# Altium schematic sheet VDD_GND.SchDoc
size E
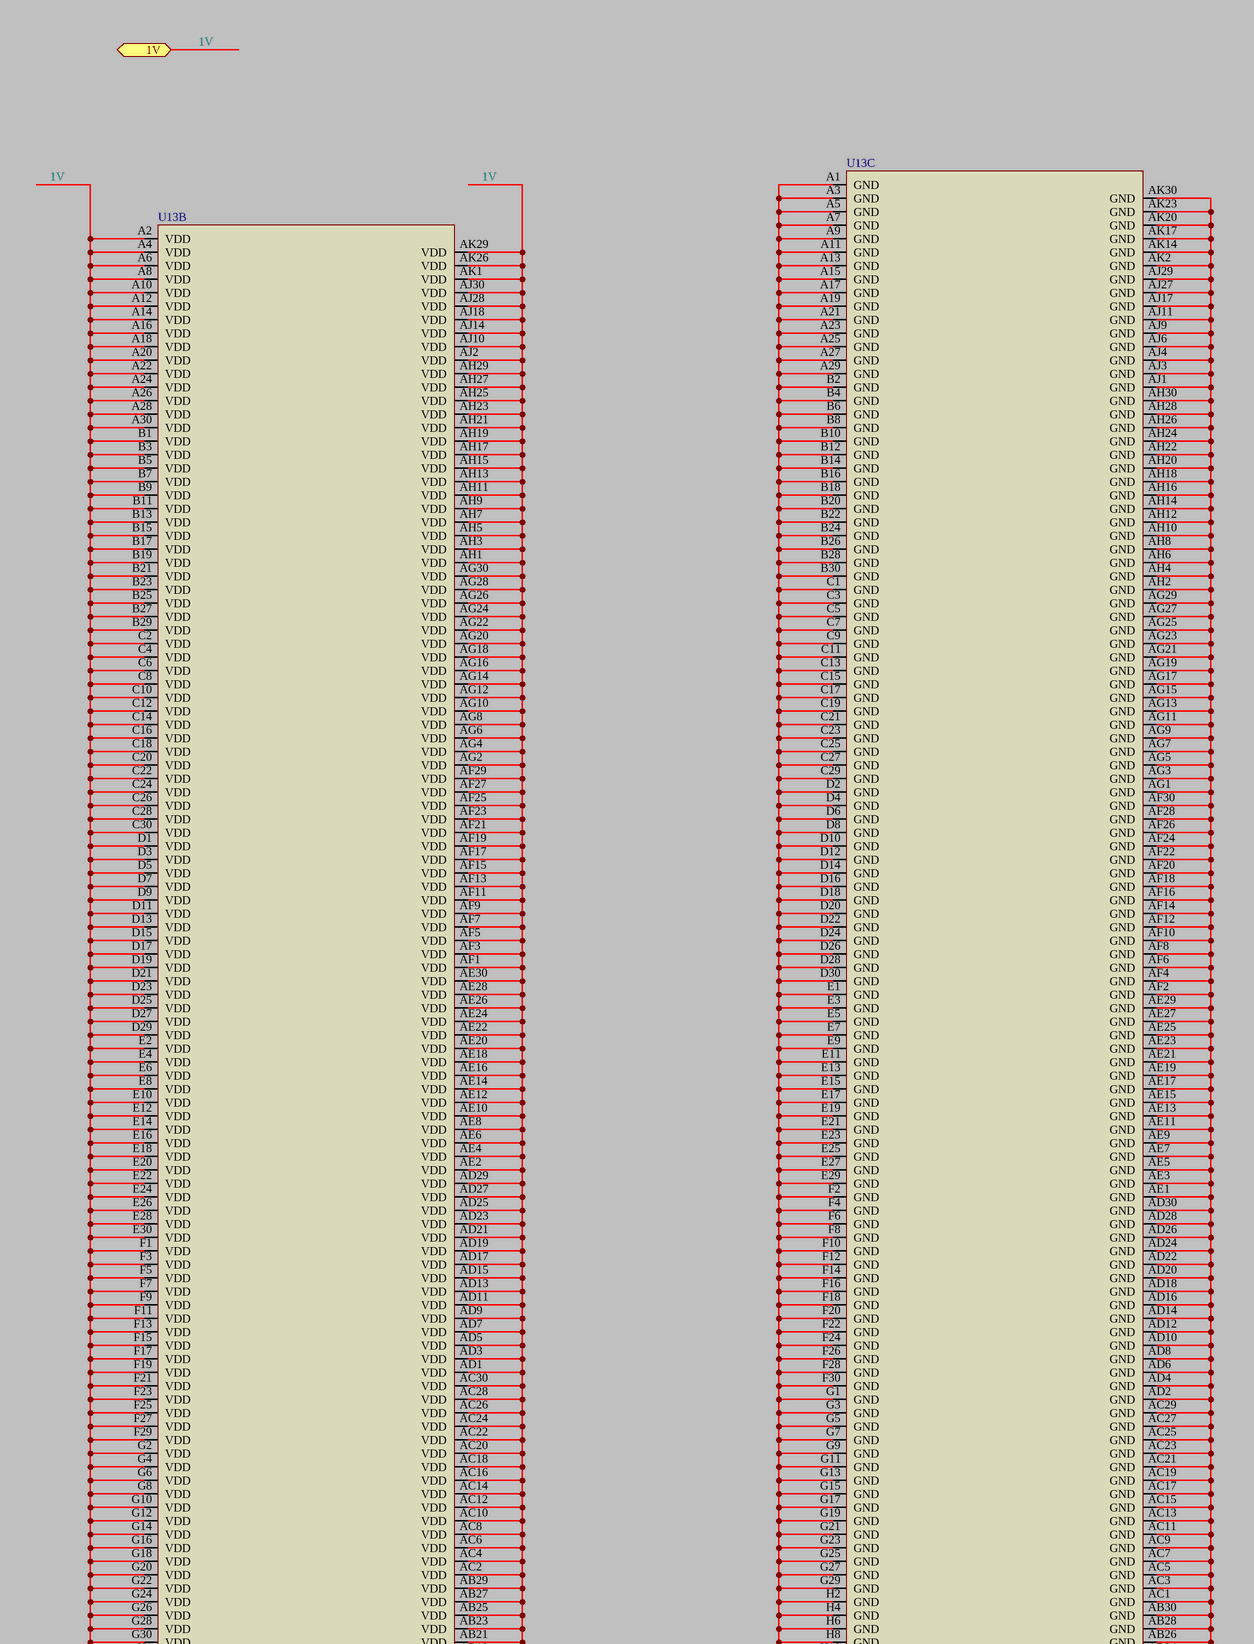
[diagram p0: VDD_GND.SchDoc, top left]
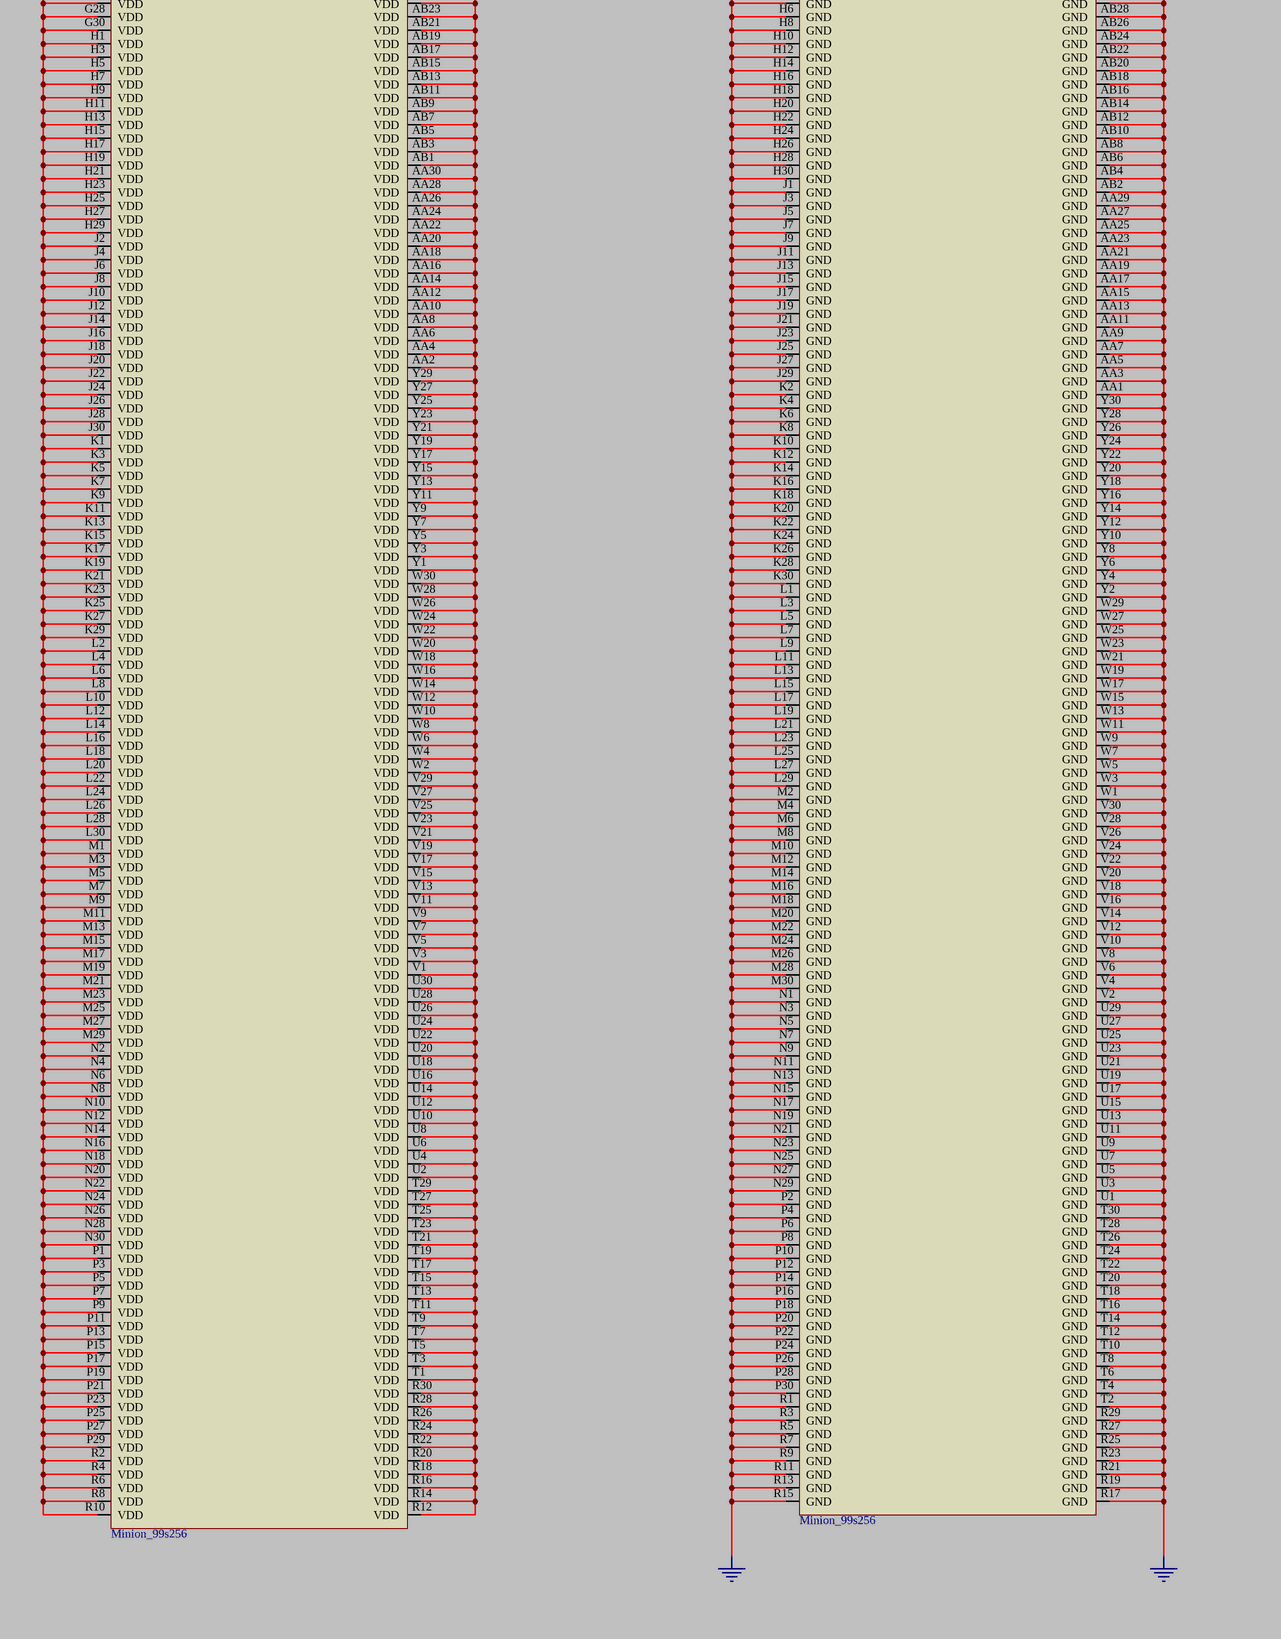
[diagram p1: VDD_GND.SchDoc, bottom left]
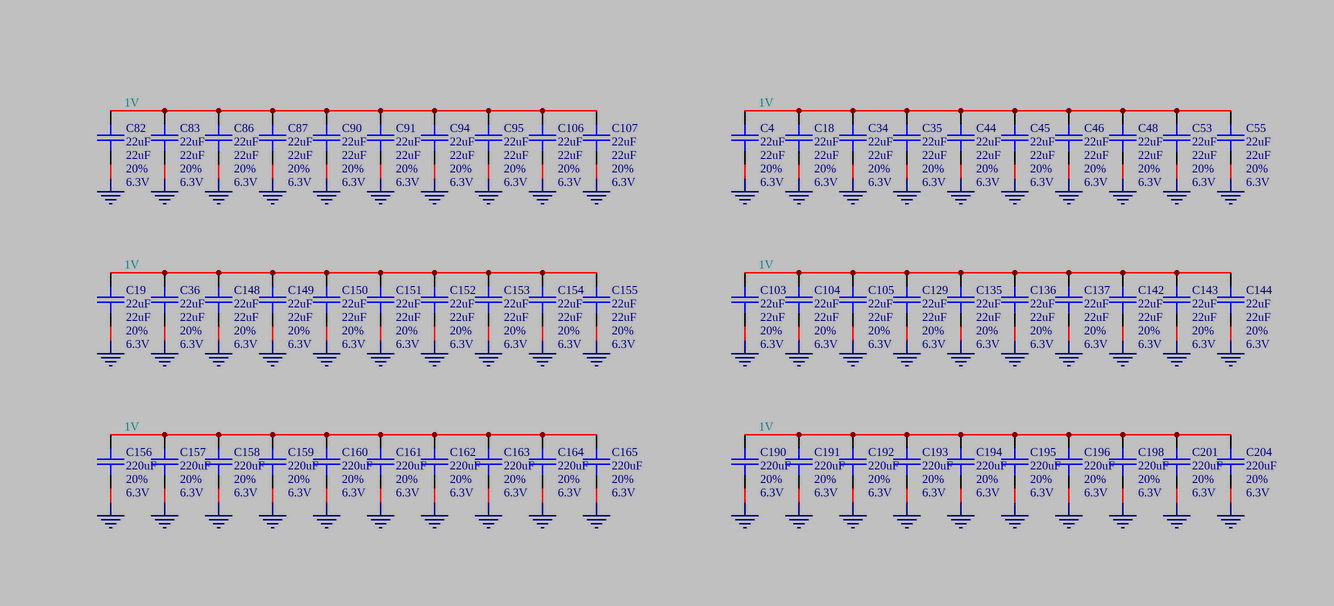
[diagram p2: VDD_GND.SchDoc, bottom middle]
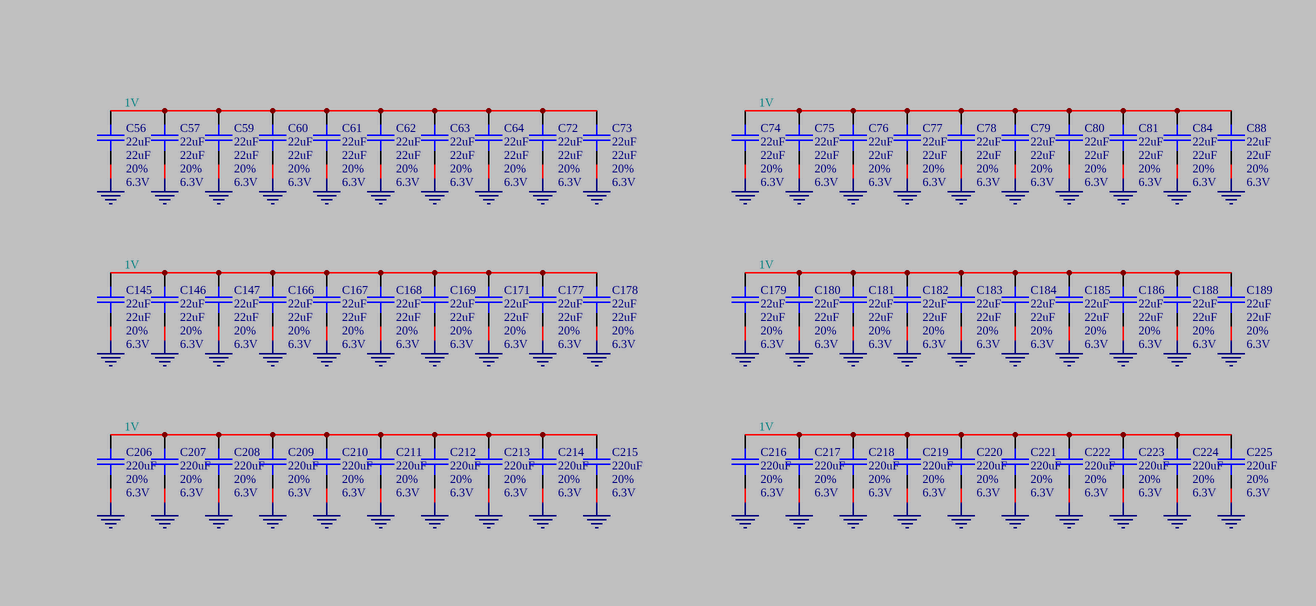
[diagram p3: VDD_GND.SchDoc, bottom right]

## Parts
C4  22uF  DB_TOLERANCE: 20%  DB_VOLTAGE: 6.3V  [SMD_0805_CAPC2012X145N]
C18  22uF  DB_TOLERANCE: 20%  DB_VOLTAGE: 6.3V  [SMD_0805_CAPC2012X145N]
C19  22uF  DB_TOLERANCE: 20%  DB_VOLTAGE: 6.3V  [SMD_0805_CAPC2012X145N]
C34  22uF  DB_TOLERANCE: 20%  DB_VOLTAGE: 6.3V  [SMD_0805_CAPC2012X145N]
C35  22uF  DB_TOLERANCE: 20%  DB_VOLTAGE: 6.3V  [SMD_0805_CAPC2012X145N]
C36  22uF  DB_TOLERANCE: 20%  DB_VOLTAGE: 6.3V  [SMD_0805_CAPC2012X145N]
C44  22uF  DB_TOLERANCE: 20%  DB_VOLTAGE: 6.3V  [SMD_0805_CAPC2012X145N]
C45  22uF  DB_TOLERANCE: 20%  DB_VOLTAGE: 6.3V  [SMD_0805_CAPC2012X145N]
C46  22uF  DB_TOLERANCE: 20%  DB_VOLTAGE: 6.3V  [SMD_0805_CAPC2012X145N]
C48  22uF  DB_TOLERANCE: 20%  DB_VOLTAGE: 6.3V  [SMD_0805_CAPC2012X145N]
C53  22uF  DB_TOLERANCE: 20%  DB_VOLTAGE: 6.3V  [SMD_0805_CAPC2012X145N]
C55  22uF  DB_TOLERANCE: 20%  DB_VOLTAGE: 6.3V  [SMD_0805_CAPC2012X145N]
C56  22uF  DB_TOLERANCE: 20%  DB_VOLTAGE: 6.3V  [SMD_0805_CAPC2012X145N]
C57  22uF  DB_TOLERANCE: 20%  DB_VOLTAGE: 6.3V  [SMD_0805_CAPC2012X145N]
C59  22uF  DB_TOLERANCE: 20%  DB_VOLTAGE: 6.3V  [SMD_0805_CAPC2012X145N]
C60  22uF  DB_TOLERANCE: 20%  DB_VOLTAGE: 6.3V  [SMD_0805_CAPC2012X145N]
C61  22uF  DB_TOLERANCE: 20%  DB_VOLTAGE: 6.3V  [SMD_0805_CAPC2012X145N]
C62  22uF  DB_TOLERANCE: 20%  DB_VOLTAGE: 6.3V  [SMD_0805_CAPC2012X145N]
C63  22uF  DB_TOLERANCE: 20%  DB_VOLTAGE: 6.3V  [SMD_0805_CAPC2012X145N]
C64  22uF  DB_TOLERANCE: 20%  DB_VOLTAGE: 6.3V  [SMD_0805_CAPC2012X145N]
C72  22uF  DB_TOLERANCE: 20%  DB_VOLTAGE: 6.3V  [SMD_0805_CAPC2012X145N]
C73  22uF  DB_TOLERANCE: 20%  DB_VOLTAGE: 6.3V  [SMD_0805_CAPC2012X145N]
C74  22uF  DB_TOLERANCE: 20%  DB_VOLTAGE: 6.3V  [SMD_0805_CAPC2012X145N]
C75  22uF  DB_TOLERANCE: 20%  DB_VOLTAGE: 6.3V  [SMD_0805_CAPC2012X145N]
C76  22uF  DB_TOLERANCE: 20%  DB_VOLTAGE: 6.3V  [SMD_0805_CAPC2012X145N]
C77  22uF  DB_TOLERANCE: 20%  DB_VOLTAGE: 6.3V  [SMD_0805_CAPC2012X145N]
C78  22uF  DB_TOLERANCE: 20%  DB_VOLTAGE: 6.3V  [SMD_0805_CAPC2012X145N]
C79  22uF  DB_TOLERANCE: 20%  DB_VOLTAGE: 6.3V  [SMD_0805_CAPC2012X145N]
C80  22uF  DB_TOLERANCE: 20%  DB_VOLTAGE: 6.3V  [SMD_0805_CAPC2012X145N]
C81  22uF  DB_TOLERANCE: 20%  DB_VOLTAGE: 6.3V  [SMD_0805_CAPC2012X145N]
C82  22uF  DB_TOLERANCE: 20%  DB_VOLTAGE: 6.3V  [SMD_0805_CAPC2012X145N]
C83  22uF  DB_TOLERANCE: 20%  DB_VOLTAGE: 6.3V  [SMD_0805_CAPC2012X145N]
C84  22uF  DB_TOLERANCE: 20%  DB_VOLTAGE: 6.3V  [SMD_0805_CAPC2012X145N]
C86  22uF  DB_TOLERANCE: 20%  DB_VOLTAGE: 6.3V  [SMD_0805_CAPC2012X145N]
C87  22uF  DB_TOLERANCE: 20%  DB_VOLTAGE: 6.3V  [SMD_0805_CAPC2012X145N]
C88  22uF  DB_TOLERANCE: 20%  DB_VOLTAGE: 6.3V  [SMD_0805_CAPC2012X145N]
C90  22uF  DB_TOLERANCE: 20%  DB_VOLTAGE: 6.3V  [SMD_0805_CAPC2012X145N]
C91  22uF  DB_TOLERANCE: 20%  DB_VOLTAGE: 6.3V  [SMD_0805_CAPC2012X145N]
C94  22uF  DB_TOLERANCE: 20%  DB_VOLTAGE: 6.3V  [SMD_0805_CAPC2012X145N]
C95  22uF  DB_TOLERANCE: 20%  DB_VOLTAGE: 6.3V  [SMD_0805_CAPC2012X145N]
C103  22uF  DB_TOLERANCE: 20%  DB_VOLTAGE: 6.3V  [SMD_0805_CAPC2012X145N]
C104  22uF  DB_TOLERANCE: 20%  DB_VOLTAGE: 6.3V  [SMD_0805_CAPC2012X145N]
C105  22uF  DB_TOLERANCE: 20%  DB_VOLTAGE: 6.3V  [SMD_0805_CAPC2012X145N]
C106  22uF  DB_TOLERANCE: 20%  DB_VOLTAGE: 6.3V  [SMD_0805_CAPC2012X145N]
C107  22uF  DB_TOLERANCE: 20%  DB_VOLTAGE: 6.3V  [SMD_0805_CAPC2012X145N]
C129  22uF  DB_TOLERANCE: 20%  DB_VOLTAGE: 6.3V  [SMD_0805_CAPC2012X145N]
C135  22uF  DB_TOLERANCE: 20%  DB_VOLTAGE: 6.3V  [SMD_0805_CAPC2012X145N]
C136  22uF  DB_TOLERANCE: 20%  DB_VOLTAGE: 6.3V  [SMD_0805_CAPC2012X145N]
C137  22uF  DB_TOLERANCE: 20%  DB_VOLTAGE: 6.3V  [SMD_0805_CAPC2012X145N]
C142  22uF  DB_TOLERANCE: 20%  DB_VOLTAGE: 6.3V  [SMD_0805_CAPC2012X145N]
C143  22uF  DB_TOLERANCE: 20%  DB_VOLTAGE: 6.3V  [SMD_0805_CAPC2012X145N]
C144  22uF  DB_TOLERANCE: 20%  DB_VOLTAGE: 6.3V  [SMD_0805_CAPC2012X145N]
C145  22uF  DB_TOLERANCE: 20%  DB_VOLTAGE: 6.3V  [SMD_0805_CAPC2012X145N]
C146  22uF  DB_TOLERANCE: 20%  DB_VOLTAGE: 6.3V  [SMD_0805_CAPC2012X145N]
C147  22uF  DB_TOLERANCE: 20%  DB_VOLTAGE: 6.3V  [SMD_0805_CAPC2012X145N]
C148  22uF  DB_TOLERANCE: 20%  DB_VOLTAGE: 6.3V  [SMD_0805_CAPC2012X145N]
C149  22uF  DB_TOLERANCE: 20%  DB_VOLTAGE: 6.3V  [SMD_0805_CAPC2012X145N]
C150  22uF  DB_TOLERANCE: 20%  DB_VOLTAGE: 6.3V  [SMD_0805_CAPC2012X145N]
C151  22uF  DB_TOLERANCE: 20%  DB_VOLTAGE: 6.3V  [SMD_0805_CAPC2012X145N]
C152  22uF  DB_TOLERANCE: 20%  DB_VOLTAGE: 6.3V  [SMD_0805_CAPC2012X145N]
C153  22uF  DB_TOLERANCE: 20%  DB_VOLTAGE: 6.3V  [SMD_0805_CAPC2012X145N]
C154  22uF  DB_TOLERANCE: 20%  DB_VOLTAGE: 6.3V  [SMD_0805_CAPC2012X145N]
C155  22uF  DB_TOLERANCE: 20%  DB_VOLTAGE: 6.3V  [SMD_0805_CAPC2012X145N]
C156  DB_TOLERANCE: 20%  DB_VOLTAGE: 6.3V  [SMD_1210_CAPC3225X279N]  (hidden comment: 220uF)
C157  DB_TOLERANCE: 20%  DB_VOLTAGE: 6.3V  [SMD_1210_CAPC3225X279N]  (hidden comment: 220uF)
C158  DB_TOLERANCE: 20%  DB_VOLTAGE: 6.3V  [SMD_1210_CAPC3225X279N]  (hidden comment: 220uF)
C159  DB_TOLERANCE: 20%  DB_VOLTAGE: 6.3V  [SMD_1210_CAPC3225X279N]  (hidden comment: 220uF)
C160  DB_TOLERANCE: 20%  DB_VOLTAGE: 6.3V  [SMD_1210_CAPC3225X279N]  (hidden comment: 220uF)
C161  DB_TOLERANCE: 20%  DB_VOLTAGE: 6.3V  [SMD_1210_CAPC3225X279N]  (hidden comment: 220uF)
C162  DB_TOLERANCE: 20%  DB_VOLTAGE: 6.3V  [SMD_1210_CAPC3225X279N]  (hidden comment: 220uF)
C163  DB_TOLERANCE: 20%  DB_VOLTAGE: 6.3V  [SMD_1210_CAPC3225X279N]  (hidden comment: 220uF)
C164  DB_TOLERANCE: 20%  DB_VOLTAGE: 6.3V  [SMD_1210_CAPC3225X279N]  (hidden comment: 220uF)
C165  DB_TOLERANCE: 20%  DB_VOLTAGE: 6.3V  [SMD_1210_CAPC3225X279N]  (hidden comment: 220uF)
C166  22uF  DB_TOLERANCE: 20%  DB_VOLTAGE: 6.3V  [SMD_0805_CAPC2012X145N]
C167  22uF  DB_TOLERANCE: 20%  DB_VOLTAGE: 6.3V  [SMD_0805_CAPC2012X145N]
C168  22uF  DB_TOLERANCE: 20%  DB_VOLTAGE: 6.3V  [SMD_0805_CAPC2012X145N]
C169  22uF  DB_TOLERANCE: 20%  DB_VOLTAGE: 6.3V  [SMD_0805_CAPC2012X145N]
C171  22uF  DB_TOLERANCE: 20%  DB_VOLTAGE: 6.3V  [SMD_0805_CAPC2012X145N]
C177  22uF  DB_TOLERANCE: 20%  DB_VOLTAGE: 6.3V  [SMD_0805_CAPC2012X145N]
C178  22uF  DB_TOLERANCE: 20%  DB_VOLTAGE: 6.3V  [SMD_0805_CAPC2012X145N]
C179  22uF  DB_TOLERANCE: 20%  DB_VOLTAGE: 6.3V  [SMD_0805_CAPC2012X145N]
C180  22uF  DB_TOLERANCE: 20%  DB_VOLTAGE: 6.3V  [SMD_0805_CAPC2012X145N]
C181  22uF  DB_TOLERANCE: 20%  DB_VOLTAGE: 6.3V  [SMD_0805_CAPC2012X145N]
C182  22uF  DB_TOLERANCE: 20%  DB_VOLTAGE: 6.3V  [SMD_0805_CAPC2012X145N]
C183  22uF  DB_TOLERANCE: 20%  DB_VOLTAGE: 6.3V  [SMD_0805_CAPC2012X145N]
C184  22uF  DB_TOLERANCE: 20%  DB_VOLTAGE: 6.3V  [SMD_0805_CAPC2012X145N]
C185  22uF  DB_TOLERANCE: 20%  DB_VOLTAGE: 6.3V  [SMD_0805_CAPC2012X145N]
C186  22uF  DB_TOLERANCE: 20%  DB_VOLTAGE: 6.3V  [SMD_0805_CAPC2012X145N]
C188  22uF  DB_TOLERANCE: 20%  DB_VOLTAGE: 6.3V  [SMD_0805_CAPC2012X145N]
C189  22uF  DB_TOLERANCE: 20%  DB_VOLTAGE: 6.3V  [SMD_0805_CAPC2012X145N]
C190  DB_TOLERANCE: 20%  DB_VOLTAGE: 6.3V  [SMD_1210_CAPC3225X279N]  (hidden comment: 220uF)
C191  DB_TOLERANCE: 20%  DB_VOLTAGE: 6.3V  [SMD_1210_CAPC3225X279N]  (hidden comment: 220uF)
C192  DB_TOLERANCE: 20%  DB_VOLTAGE: 6.3V  [SMD_1210_CAPC3225X279N]  (hidden comment: 220uF)
C193  DB_TOLERANCE: 20%  DB_VOLTAGE: 6.3V  [SMD_1210_CAPC3225X279N]  (hidden comment: 220uF)
C194  DB_TOLERANCE: 20%  DB_VOLTAGE: 6.3V  [SMD_1210_CAPC3225X279N]  (hidden comment: 220uF)
C195  DB_TOLERANCE: 20%  DB_VOLTAGE: 6.3V  [SMD_1210_CAPC3225X279N]  (hidden comment: 220uF)
C196  DB_TOLERANCE: 20%  DB_VOLTAGE: 6.3V  [SMD_1210_CAPC3225X279N]  (hidden comment: 220uF)
C198  DB_TOLERANCE: 20%  DB_VOLTAGE: 6.3V  [SMD_1210_CAPC3225X279N]  (hidden comment: 220uF)
C201  DB_TOLERANCE: 20%  DB_VOLTAGE: 6.3V  [SMD_1210_CAPC3225X279N]  (hidden comment: 220uF)
C204  DB_TOLERANCE: 20%  DB_VOLTAGE: 6.3V  [SMD_1210_CAPC3225X279N]  (hidden comment: 220uF)
C206  DB_TOLERANCE: 20%  DB_VOLTAGE: 6.3V  [SMD_1210_CAPC3225X279N]  (hidden comment: 220uF)
C207  DB_TOLERANCE: 20%  DB_VOLTAGE: 6.3V  [SMD_1210_CAPC3225X279N]  (hidden comment: 220uF)
C208  DB_TOLERANCE: 20%  DB_VOLTAGE: 6.3V  [SMD_1210_CAPC3225X279N]  (hidden comment: 220uF)
C209  DB_TOLERANCE: 20%  DB_VOLTAGE: 6.3V  [SMD_1210_CAPC3225X279N]  (hidden comment: 220uF)
C210  DB_TOLERANCE: 20%  DB_VOLTAGE: 6.3V  [SMD_1210_CAPC3225X279N]  (hidden comment: 220uF)
C211  DB_TOLERANCE: 20%  DB_VOLTAGE: 6.3V  [SMD_1210_CAPC3225X279N]  (hidden comment: 220uF)
C212  DB_TOLERANCE: 20%  DB_VOLTAGE: 6.3V  [SMD_1210_CAPC3225X279N]  (hidden comment: 220uF)
C213  DB_TOLERANCE: 20%  DB_VOLTAGE: 6.3V  [SMD_1210_CAPC3225X279N]  (hidden comment: 220uF)
C214  DB_TOLERANCE: 20%  DB_VOLTAGE: 6.3V  [SMD_1210_CAPC3225X279N]  (hidden comment: 220uF)
C215  DB_TOLERANCE: 20%  DB_VOLTAGE: 6.3V  [SMD_1210_CAPC3225X279N]  (hidden comment: 220uF)
C216  DB_TOLERANCE: 20%  DB_VOLTAGE: 6.3V  [SMD_1210_CAPC3225X279N]  (hidden comment: 220uF)
C217  DB_TOLERANCE: 20%  DB_VOLTAGE: 6.3V  [SMD_1210_CAPC3225X279N]  (hidden comment: 220uF)
C218  DB_TOLERANCE: 20%  DB_VOLTAGE: 6.3V  [SMD_1210_CAPC3225X279N]  (hidden comment: 220uF)
C219  DB_TOLERANCE: 20%  DB_VOLTAGE: 6.3V  [SMD_1210_CAPC3225X279N]  (hidden comment: 220uF)
C220  DB_TOLERANCE: 20%  DB_VOLTAGE: 6.3V  [SMD_1210_CAPC3225X279N]  (hidden comment: 220uF)
C221  DB_TOLERANCE: 20%  DB_VOLTAGE: 6.3V  [SMD_1210_CAPC3225X279N]  (hidden comment: 220uF)
C222  DB_TOLERANCE: 20%  DB_VOLTAGE: 6.3V  [SMD_1210_CAPC3225X279N]  (hidden comment: 220uF)
C223  DB_TOLERANCE: 20%  DB_VOLTAGE: 6.3V  [SMD_1210_CAPC3225X279N]  (hidden comment: 220uF)
C224  DB_TOLERANCE: 20%  DB_VOLTAGE: 6.3V  [SMD_1210_CAPC3225X279N]  (hidden comment: 220uF)
C225  DB_TOLERANCE: 20%  DB_VOLTAGE: 6.3V  [SMD_1210_CAPC3225X279N]  (hidden comment: 220uF)
U13  Minion_99s256  [SMD_BGA900C80P30X30]  (parts B,C of 3)

## Ports
1V

## Nets
GND: C4.1 C18.1 C19.1 C34.1 C35.1 C36.1 C44.1 C45.1 C46.1 C48.1 C53.1 C55.1 C56.1 C57.1 C59.1 C60.1 C61.1 C62.1 C63.1 C64.1 C72.1 C73.1 C74.1 C75.1 C76.1 C77.1 C78.1 C79.1 C80.1 C81.1 C82.1 C83.1 C84.1 C86.1 C87.1 C88.1 C90.1 C91.1 C94.1 C95.1 C103.1 C104.1 C105.1 C106.1 C107.1 C129.1 C135.1 C136.1 C137.1 C142.1 C143.1 C144.1 C145.1 C146.1 C147.1 C148.1 C149.1 C150.1 C151.1 C152.1 C153.1 C154.1 C155.1 C156.1 C157.1 C158.1 C159.1 C160.1 C161.1 C162.1 C163.1 C164.1 C165.1 C166.1 C167.1 C168.1 C169.1 C171.1 C177.1 C178.1 C179.1 C180.1 C181.1 C182.1 C183.1 C184.1 C185.1 C186.1 C188.1 C189.1 C190.1 C191.1 C192.1 C193.1 C194.1 C195.1 C196.1 C198.1 C201.1 C204.1 C206.1 C207.1 C208.1 C209.1 C210.1 C211.1 C212.1 C213.1 C214.1 C215.1 C216.1 C217.1 C218.1 C219.1 C220.1 C221.1 C222.1 C223.1 C224.1 C225.1 U13.A1(GND) U13.A3(GND) U13.A5(GND) U13.A7(GND) U13.A9(GND) U13.A11(GND) U13.A13(GND) U13.A15(GND) U13.A17(GND) U13.A19(GND) U13.A21(GND) U13.A23(GND) U13.A25(GND) U13.A27(GND) U13.A29(GND) U13.AA1(GND) U13.AA3(GND) U13.AA5(GND) U13.AA7(GND) U13.AA9(GND) U13.AA11(GND) U13.AA13(GND) U13.AA15(GND) U13.AA17(GND) U13.AA19(GND) U13.AA21(GND) U13.AA23(GND) U13.AA25(GND) U13.AA27(GND) U13.AA29(GND) U13.AB2(GND) U13.AB4(GND) U13.AB6(GND) U13.AB8(GND) U13.AB10(GND) U13.AB12(GND) U13.AB14(GND) U13.AB16(GND) U13.AB18(GND) U13.AB20(GND) U13.AB22(GND) U13.AB24(GND) U13.AB26(GND) U13.AB28(GND) U13.AB30(GND) U13.AC1(GND) U13.AC3(GND) U13.AC5(GND) U13.AC7(GND) U13.AC9(GND) U13.AC11(GND) U13.AC13(GND) U13.AC15(GND) U13.AC17(GND) U13.AC19(GND) U13.AC21(GND) U13.AC23(GND) U13.AC25(GND) U13.AC27(GND) U13.AC29(GND) U13.AD2(GND) U13.AD4(GND) U13.AD6(GND) U13.AD8(GND) U13.AD10(GND) U13.AD12(GND) U13.AD14(GND) U13.AD16(GND) U13.AD18(GND) U13.AD20(GND) U13.AD22(GND) U13.AD24(GND) U13.AD26(GND) U13.AD28(GND) U13.AD30(GND) U13.AE1(GND) U13.AE3(GND) U13.AE5(GND) U13.AE7(GND) U13.AE9(GND) U13.AE11(GND) U13.AE13(GND) U13.AE15(GND) U13.AE17(GND) U13.AE19(GND) U13.AE21(GND) U13.AE23(GND) U13.AE25(GND) U13.AE27(GND) U13.AE29(GND) U13.AF2(GND) U13.AF4(GND) U13.AF6(GND) U13.AF8(GND) U13.AF10(GND) U13.AF12(GND) U13.AF14(GND) U13.AF16(GND) U13.AF18(GND) U13.AF20(GND) U13.AF22(GND) U13.AF24(GND) U13.AF26(GND) U13.AF28(GND) U13.AF30(GND) U13.AG1(GND) U13.AG3(GND) U13.AG5(GND) U13.AG7(GND) U13.AG9(GND) U13.AG11(GND) U13.AG13(GND) U13.AG15(GND) U13.AG17(GND) U13.AG19(GND) U13.AG21(GND) U13.AG23(GND) U13.AG25(GND) U13.AG27(GND) U13.AG29(GND) U13.AH2(GND) U13.AH4(GND) U13.AH6(GND) U13.AH8(GND) U13.AH10(GND) U13.AH12(GND) U13.AH14(GND) U13.AH16(GND) U13.AH18(GND) U13.AH20(GND) U13.AH22(GND) U13.AH24(GND) U13.AH26(GND) U13.AH28(GND) U13.AH30(GND) U13.AJ1(GND) U13.AJ3(GND) U13.AJ4(GND) U13.AJ6(GND) U13.AJ9(GND) U13.AJ11(GND) U13.AJ17(GND) U13.AJ27(GND) U13.AJ29(GND) U13.AK2(GND) U13.AK14(GND) U13.AK17(GND) U13.AK20(GND) U13.AK23(GND) U13.AK30(GND) U13.B2(GND) U13.B4(GND) U13.B6(GND) U13.B8(GND) U13.B10(GND) U13.B12(GND) U13.B14(GND) U13.B16(GND) U13.B18(GND) U13.B20(GND) U13.B22(GND) U13.B24(GND) U13.B26(GND) U13.B28(GND) U13.B30(GND) U13.C1(GND) U13.C3(GND) U13.C5(GND) U13.C7(GND) U13.C9(GND) U13.C11(GND) U13.C13(GND) U13.C15(GND) U13.C17(GND) U13.C19(GND) U13.C21(GND) U13.C23(GND) U13.C25(GND) U13.C27(GND) U13.C29(GND) U13.D2(GND) U13.D4(GND) U13.D6(GND) U13.D8(GND) U13.D10(GND) U13.D12(GND) U13.D14(GND) U13.D16(GND) U13.D18(GND) U13.D20(GND) U13.D22(GND) U13.D24(GND) U13.D26(GND) U13.D28(GND) U13.D30(GND) U13.E1(GND) U13.E3(GND) U13.E5(GND) U13.E7(GND) U13.E9(GND) U13.E11(GND) U13.E13(GND) U13.E15(GND) U13.E17(GND) U13.E19(GND) U13.E21(GND) U13.E23(GND) U13.E25(GND) U13.E27(GND) U13.E29(GND) U13.F2(GND) U13.F4(GND) U13.F6(GND) U13.F8(GND) U13.F10(GND) U13.F12(GND) U13.F14(GND) U13.F16(GND) U13.F18(GND) U13.F20(GND) U13.F22(GND) U13.F24(GND) U13.F26(GND) U13.F28(GND) U13.F30(GND) U13.G1(GND) U13.G3(GND) U13.G5(GND) U13.G7(GND) U13.G9(GND) U13.G11(GND) U13.G13(GND) U13.G15(GND) U13.G17(GND) U13.G19(GND) U13.G21(GND) U13.G23(GND) U13.G25(GND) U13.G27(GND) U13.G29(GND) U13.H2(GND) U13.H4(GND) U13.H6(GND) U13.H8(GND) U13.H10(GND) U13.H12(GND) U13.H14(GND) U13.H16(GND) U13.H18(GND) U13.H20(GND) U13.H22(GND) U13.H24(GND) U13.H26(GND) U13.H28(GND) U13.H30(GND) U13.J1(GND) U13.J3(GND) U13.J5(GND) U13.J7(GND) U13.J9(GND) U13.J11(GND) U13.J13(GND) U13.J15(GND) U13.J17(GND) U13.J19(GND) U13.J21(GND) U13.J23(GND) U13.J25(GND) U13.J27(GND) U13.J29(GND) U13.K2(GND) U13.K4(GND) U13.K6(GND) U13.K8(GND) U13.K10(GND) U13.K12(GND) U13.K14(GND) U13.K16(GND) U13.K18(GND) U13.K20(GND) U13.K22(GND) U13.K24(GND) U13.K26(GND) U13.K28(GND) U13.K30(GND) U13.L1(GND) U13.L3(GND) U13.L5(GND) U13.L7(GND) U13.L9(GND) U13.L11(GND) U13.L13(GND) U13.L15(GND) U13.L17(GND) U13.L19(GND) U13.L21(GND) U13.L23(GND) U13.L25(GND) U13.L27(GND) U13.L29(GND) U13.M2(GND) U13.M4(GND) U13.M6(GND) U13.M8(GND) U13.M10(GND) U13.M12(GND) U13.M14(GND) U13.M16(GND) U13.M18(GND) U13.M20(GND) U13.M22(GND) U13.M24(GND) U13.M26(GND) U13.M28(GND) U13.M30(GND) U13.N1(GND) U13.N3(GND) U13.N5(GND) U13.N7(GND) U13.N9(GND) U13.N11(GND) U13.N13(GND) U13.N15(GND) U13.N17(GND) U13.N19(GND) U13.N21(GND) U13.N23(GND) U13.N25(GND) U13.N27(GND) U13.N29(GND) U13.P2(GND) U13.P4(GND) U13.P6(GND) U13.P8(GND) U13.P10(GND) U13.P12(GND) U13.P14(GND) U13.P16(GND) U13.P18(GND) U13.P20(GND) U13.P22(GND) U13.P24(GND) U13.P26(GND) U13.P28(GND) U13.P30(GND) U13.R1(GND) U13.R3(GND) U13.R5(GND) U13.R7(GND) U13.R9(GND) U13.R11(GND) U13.R13(GND) U13.R15(GND) U13.R17(GND) U13.R19(GND) U13.R21(GND) U13.R23(GND) U13.R25(GND) U13.R27(GND) U13.R29(GND) U13.T2(GND) U13.T4(GND) U13.T6(GND) U13.T8(GND) U13.T10(GND) U13.T12(GND) U13.T14(GND) U13.T16(GND) U13.T18(GND) U13.T20(GND) U13.T22(GND) U13.T24(GND) U13.T26(GND) U13.T28(GND) U13.T30(GND) U13.U1(GND) U13.U3(GND) U13.U5(GND) U13.U7(GND) U13.U9(GND) U13.U11(GND) U13.U13(GND) U13.U15(GND) U13.U17(GND) U13.U19(GND) U13.U21(GND) U13.U23(GND) U13.U25(GND) U13.U27(GND) U13.U29(GND) U13.V2(GND) U13.V4(GND) U13.V6(GND) U13.V8(GND) U13.V10(GND) U13.V12(GND) U13.V14(GND) U13.V16(GND) U13.V18(GND) U13.V20(GND) U13.V22(GND) U13.V24(GND) U13.V26(GND) U13.V28(GND) U13.V30(GND) U13.W1(GND) U13.W3(GND) U13.W5(GND) U13.W7(GND) U13.W9(GND) U13.W11(GND) U13.W13(GND) U13.W15(GND) U13.W17(GND) U13.W19(GND) U13.W21(GND) U13.W23(GND) U13.W25(GND) U13.W27(GND) U13.W29(GND) U13.Y2(GND) U13.Y4(GND) U13.Y6(GND) U13.Y8(GND) U13.Y10(GND) U13.Y12(GND) U13.Y14(GND) U13.Y16(GND) U13.Y18(GND) U13.Y20(GND) U13.Y22(GND) U13.Y24(GND) U13.Y26(GND) U13.Y28(GND) U13.Y30(GND)
1V: C4.2 C18.2 C19.2 C34.2 C35.2 C36.2 C44.2 C45.2 C46.2 C48.2 C53.2 C55.2 C56.2 C57.2 C59.2 C60.2 C61.2 C62.2 C63.2 C64.2 C72.2 C73.2 C74.2 C75.2 C76.2 C77.2 C78.2 C79.2 C80.2 C81.2 C82.2 C83.2 C84.2 C86.2 C87.2 C88.2 C90.2 C91.2 C94.2 C95.2 C103.2 C104.2 C105.2 C106.2 C107.2 C129.2 C135.2 C136.2 C137.2 C142.2 C143.2 C144.2 C145.2 C146.2 C147.2 C148.2 C149.2 C150.2 C151.2 C152.2 C153.2 C154.2 C155.2 C156.2 C157.2 C158.2 C159.2 C160.2 C161.2 C162.2 C163.2 C164.2 C165.2 C166.2 C167.2 C168.2 C169.2 C171.2 C177.2 C178.2 C179.2 C180.2 C181.2 C182.2 C183.2 C184.2 C185.2 C186.2 C188.2 C189.2 C190.2 C191.2 C192.2 C193.2 C194.2 C195.2 C196.2 C198.2 C201.2 C204.2 C206.2 C207.2 C208.2 C209.2 C210.2 C211.2 C212.2 C213.2 C214.2 C215.2 C216.2 C217.2 C218.2 C219.2 C220.2 C221.2 C222.2 C223.2 C224.2 C225.2 U13.A2(VDD) U13.A4(VDD) U13.A6(VDD) U13.A8(VDD) U13.A10(VDD) U13.A12(VDD) U13.A14(VDD) U13.A16(VDD) U13.A18(VDD) U13.A20(VDD) U13.A22(VDD) U13.A24(VDD) U13.A26(VDD) U13.A28(VDD) U13.A30(VDD) U13.AA2(VDD) U13.AA4(VDD) U13.AA6(VDD) U13.AA8(VDD) U13.AA10(VDD) U13.AA12(VDD) U13.AA14(VDD) U13.AA16(VDD) U13.AA18(VDD) U13.AA20(VDD) U13.AA22(VDD) U13.AA24(VDD) U13.AA26(VDD) U13.AA28(VDD) U13.AA30(VDD) U13.AB1(VDD) U13.AB3(VDD) U13.AB5(VDD) U13.AB7(VDD) U13.AB9(VDD) U13.AB11(VDD) U13.AB13(VDD) U13.AB15(VDD) U13.AB17(VDD) U13.AB19(VDD) U13.AB21(VDD) U13.AB23(VDD) U13.AB25(VDD) U13.AB27(VDD) U13.AB29(VDD) U13.AC2(VDD) U13.AC4(VDD) U13.AC6(VDD) U13.AC8(VDD) U13.AC10(VDD) U13.AC12(VDD) U13.AC14(VDD) U13.AC16(VDD) U13.AC18(VDD) U13.AC20(VDD) U13.AC22(VDD) U13.AC24(VDD) U13.AC26(VDD) U13.AC28(VDD) U13.AC30(VDD) U13.AD1(VDD) U13.AD3(VDD) U13.AD5(VDD) U13.AD7(VDD) U13.AD9(VDD) U13.AD11(VDD) U13.AD13(VDD) U13.AD15(VDD) U13.AD17(VDD) U13.AD19(VDD) U13.AD21(VDD) U13.AD23(VDD) U13.AD25(VDD) U13.AD27(VDD) U13.AD29(VDD) U13.AE2(VDD) U13.AE4(VDD) U13.AE6(VDD) U13.AE8(VDD) U13.AE10(VDD) U13.AE12(VDD) U13.AE14(VDD) U13.AE16(VDD) U13.AE18(VDD) U13.AE20(VDD) U13.AE22(VDD) U13.AE24(VDD) U13.AE26(VDD) U13.AE28(VDD) U13.AE30(VDD) U13.AF1(VDD) U13.AF3(VDD) U13.AF5(VDD) U13.AF7(VDD) U13.AF9(VDD) U13.AF11(VDD) U13.AF13(VDD) U13.AF15(VDD) U13.AF17(VDD) U13.AF19(VDD) U13.AF21(VDD) U13.AF23(VDD) U13.AF25(VDD) U13.AF27(VDD) U13.AF29(VDD) U13.AG2(VDD) U13.AG4(VDD) U13.AG6(VDD) U13.AG8(VDD) U13.AG10(VDD) U13.AG12(VDD) U13.AG14(VDD) U13.AG16(VDD) U13.AG18(VDD) U13.AG20(VDD) U13.AG22(VDD) U13.AG24(VDD) U13.AG26(VDD) U13.AG28(VDD) U13.AG30(VDD) U13.AH1(VDD) U13.AH3(VDD) U13.AH5(VDD) U13.AH7(VDD) U13.AH9(VDD) U13.AH11(VDD) U13.AH13(VDD) U13.AH15(VDD) U13.AH17(VDD) U13.AH19(VDD) U13.AH21(VDD) U13.AH23(VDD) U13.AH25(VDD) U13.AH27(VDD) U13.AH29(VDD) U13.AJ2(VDD) U13.AJ10(VDD) U13.AJ14(VDD) U13.AJ18(VDD) U13.AJ28(VDD) U13.AJ30(VDD) U13.AK1(VDD) U13.AK26(VDD) U13.AK29(VDD) U13.B1(VDD) U13.B3(VDD) U13.B5(VDD) U13.B7(VDD) U13.B9(VDD) U13.B11(VDD) U13.B13(VDD) U13.B15(VDD) U13.B17(VDD) U13.B19(VDD) U13.B21(VDD) U13.B23(VDD) U13.B25(VDD) U13.B27(VDD) U13.B29(VDD) U13.C2(VDD) U13.C4(VDD) U13.C6(VDD) U13.C8(VDD) U13.C10(VDD) U13.C12(VDD) U13.C14(VDD) U13.C16(VDD) U13.C18(VDD) U13.C20(VDD) U13.C22(VDD) U13.C24(VDD) U13.C26(VDD) U13.C28(VDD) U13.C30(VDD) U13.D1(VDD) U13.D3(VDD) U13.D5(VDD) U13.D7(VDD) U13.D9(VDD) U13.D11(VDD) U13.D13(VDD) U13.D15(VDD) U13.D17(VDD) U13.D19(VDD) U13.D21(VDD) U13.D23(VDD) U13.D25(VDD) U13.D27(VDD) U13.D29(VDD) U13.E2(VDD) U13.E4(VDD) U13.E6(VDD) U13.E8(VDD) U13.E10(VDD) U13.E12(VDD) U13.E14(VDD) U13.E16(VDD) U13.E18(VDD) U13.E20(VDD) U13.E22(VDD) U13.E24(VDD) U13.E26(VDD) U13.E28(VDD) U13.E30(VDD) U13.F1(VDD) U13.F3(VDD) U13.F5(VDD) U13.F7(VDD) U13.F9(VDD) U13.F11(VDD) U13.F13(VDD) U13.F15(VDD) U13.F17(VDD) U13.F19(VDD) U13.F21(VDD) U13.F23(VDD) U13.F25(VDD) U13.F27(VDD) U13.F29(VDD) U13.G2(VDD) U13.G4(VDD) U13.G6(VDD) U13.G8(VDD) U13.G10(VDD) U13.G12(VDD) U13.G14(VDD) U13.G16(VDD) U13.G18(VDD) U13.G20(VDD) U13.G22(VDD) U13.G24(VDD) U13.G26(VDD) U13.G28(VDD) U13.G30(VDD) U13.H1(VDD) U13.H3(VDD) U13.H5(VDD) U13.H7(VDD) U13.H9(VDD) U13.H11(VDD) U13.H13(VDD) U13.H15(VDD) U13.H17(VDD) U13.H19(VDD) U13.H21(VDD) U13.H23(VDD) U13.H25(VDD) U13.H27(VDD) U13.H29(VDD) U13.J2(VDD) U13.J4(VDD) U13.J6(VDD) U13.J8(VDD) U13.J10(VDD) U13.J12(VDD) U13.J14(VDD) U13.J16(VDD) U13.J18(VDD) U13.J20(VDD) U13.J22(VDD) U13.J24(VDD) U13.J26(VDD) U13.J28(VDD) U13.J30(VDD) U13.K1(VDD) U13.K3(VDD) U13.K5(VDD) U13.K7(VDD) U13.K9(VDD) U13.K11(VDD) U13.K13(VDD) U13.K15(VDD) U13.K17(VDD) U13.K19(VDD) U13.K21(VDD) U13.K23(VDD) U13.K25(VDD) U13.K27(VDD) U13.K29(VDD) U13.L2(VDD) U13.L4(VDD) U13.L6(VDD) U13.L8(VDD) U13.L10(VDD) U13.L12(VDD) U13.L14(VDD) U13.L16(VDD) U13.L18(VDD) U13.L20(VDD) U13.L22(VDD) U13.L24(VDD) U13.L26(VDD) U13.L28(VDD) U13.L30(VDD) U13.M1(VDD) U13.M3(VDD) U13.M5(VDD) U13.M7(VDD) U13.M9(VDD) U13.M11(VDD) U13.M13(VDD) U13.M15(VDD) U13.M17(VDD) U13.M19(VDD) U13.M21(VDD) U13.M23(VDD) U13.M25(VDD) U13.M27(VDD) U13.M29(VDD) U13.N2(VDD) U13.N4(VDD) U13.N6(VDD) U13.N8(VDD) U13.N10(VDD) U13.N12(VDD) U13.N14(VDD) U13.N16(VDD) U13.N18(VDD) U13.N20(VDD) U13.N22(VDD) U13.N24(VDD) U13.N26(VDD) U13.N28(VDD) U13.N30(VDD) U13.P1(VDD) U13.P3(VDD) U13.P5(VDD) U13.P7(VDD) U13.P9(VDD) U13.P11(VDD) U13.P13(VDD) U13.P15(VDD) U13.P17(VDD) U13.P19(VDD) U13.P21(VDD) U13.P23(VDD) U13.P25(VDD) U13.P27(VDD) U13.P29(VDD) U13.R2(VDD) U13.R4(VDD) U13.R6(VDD) U13.R8(VDD) U13.R10(VDD) U13.R12(VDD) U13.R14(VDD) U13.R16(VDD) U13.R18(VDD) U13.R20(VDD) U13.R22(VDD) U13.R24(VDD) U13.R26(VDD) U13.R28(VDD) U13.R30(VDD) U13.T1(VDD) U13.T3(VDD) U13.T5(VDD) U13.T7(VDD) U13.T9(VDD) U13.T11(VDD) U13.T13(VDD) U13.T15(VDD) U13.T17(VDD) U13.T19(VDD) U13.T21(VDD) U13.T23(VDD) U13.T25(VDD) U13.T27(VDD) U13.T29(VDD) U13.U2(VDD) U13.U4(VDD) U13.U6(VDD) U13.U8(VDD) U13.U10(VDD) U13.U12(VDD) U13.U14(VDD) U13.U16(VDD) U13.U18(VDD) U13.U20(VDD) U13.U22(VDD) U13.U24(VDD) U13.U26(VDD) U13.U28(VDD) U13.U30(VDD) U13.V1(VDD) U13.V3(VDD) U13.V5(VDD) U13.V7(VDD) U13.V9(VDD) U13.V11(VDD) U13.V13(VDD) U13.V15(VDD) U13.V17(VDD) U13.V19(VDD) U13.V21(VDD) U13.V23(VDD) U13.V25(VDD) U13.V27(VDD) U13.V29(VDD) U13.W2(VDD) U13.W4(VDD) U13.W6(VDD) U13.W8(VDD) U13.W10(VDD) U13.W12(VDD) U13.W14(VDD) U13.W16(VDD) U13.W18(VDD) U13.W20(VDD) U13.W22(VDD) U13.W24(VDD) U13.W26(VDD) U13.W28(VDD) U13.W30(VDD) U13.Y1(VDD) U13.Y3(VDD) U13.Y5(VDD) U13.Y7(VDD) U13.Y9(VDD) U13.Y11(VDD) U13.Y13(VDD) U13.Y15(VDD) U13.Y17(VDD) U13.Y19(VDD) U13.Y21(VDD) U13.Y23(VDD) U13.Y25(VDD) U13.Y27(VDD) U13.Y29(VDD) ; port 1V

## Library data of the parts
C4 C18 C19 C34-C36 C44-C46 C48 C53 C55-C57 C59-C64 C72-C84 C86-C88 C90 C91 C94 C95 C103-C107 C129 C135-C137 C142-C155 C166-C169 C171 C177-C186 C188 C189 = CAP000043686: DB_PART_TYPE: Ceramic_SMD\Standard_X5R; DB_MANUFACTURER_PART: KEMET    C0805C226M9PAC; NOTE: <NOTE>; DB_T_RANGE: -55 to 85; DB_PACKAGE: 0805; DB_DESCRIPTION: C X5R 22uF 20% 6.3V 0805; DB_CERTIFIED: ISHIDDEN=T; DB_APPROVED_ON: 09.10.2010 г.; DB_STATUS: NEW; DB_PART_NUMBER: CAP000043686; DB_VALUE: 22uF; DB_PCB_DEVICE: SMD_0805_CAPC2012X145N; DB_PRICE: ISHIDDEN=T; DB_LEADTIME: ISHIDDEN=T; DB_MOQ: ISHIDDEN=T; DB_PRICE_DATE: ISHIDDEN=T; DB_APPROVED_BY: ISHIDDEN=T; DB_DATASHEET: http://john.epiqdesign.com/projects/CIS_Datasheets/F3102_CE_Kemet.pdf?rev=92&sc=0
C156-C165 C190-C196 C198 C201 C204 C206-C225 = CAP000047355: DB_PART_TYPE: Ceramic_SMD\Standard_X5R; DB_MANUFACTURER_PART: SAMSUNG    CL32A227MQVNNNE; NOTE: <NOTE>; DB_T_RANGE: -55 to 85; DB_PACKAGE: 1210; DB_DESCRIPTION: C X5R 220uF 20% 6.3V 1210; DB_CERTIFIED: ISHIDDEN=T; DB_APPROVED_BY: VSN; DB_APPROVED_ON: 07.5.2014 г. 11:28:08; DB_STATUS: NEW; DB_PART_NUMBER: CAP000047355; DB_VALUE: 220uF; DB_PCB_DEVICE: SMD_1210_CAPC3225X279N; DB_DATASHEET: http://john.epiqdesign.com/projects/CIS_Datasheets/CAP_CL32A227MQVNNNE.pdf?rev=1401&sc=0
U13 = Minion_99s256: DB_PCB_DEVICE: SMD_BGA900C80P30X30